# EAGLE design SolarBase731-v02 (EAGLE 5.10)
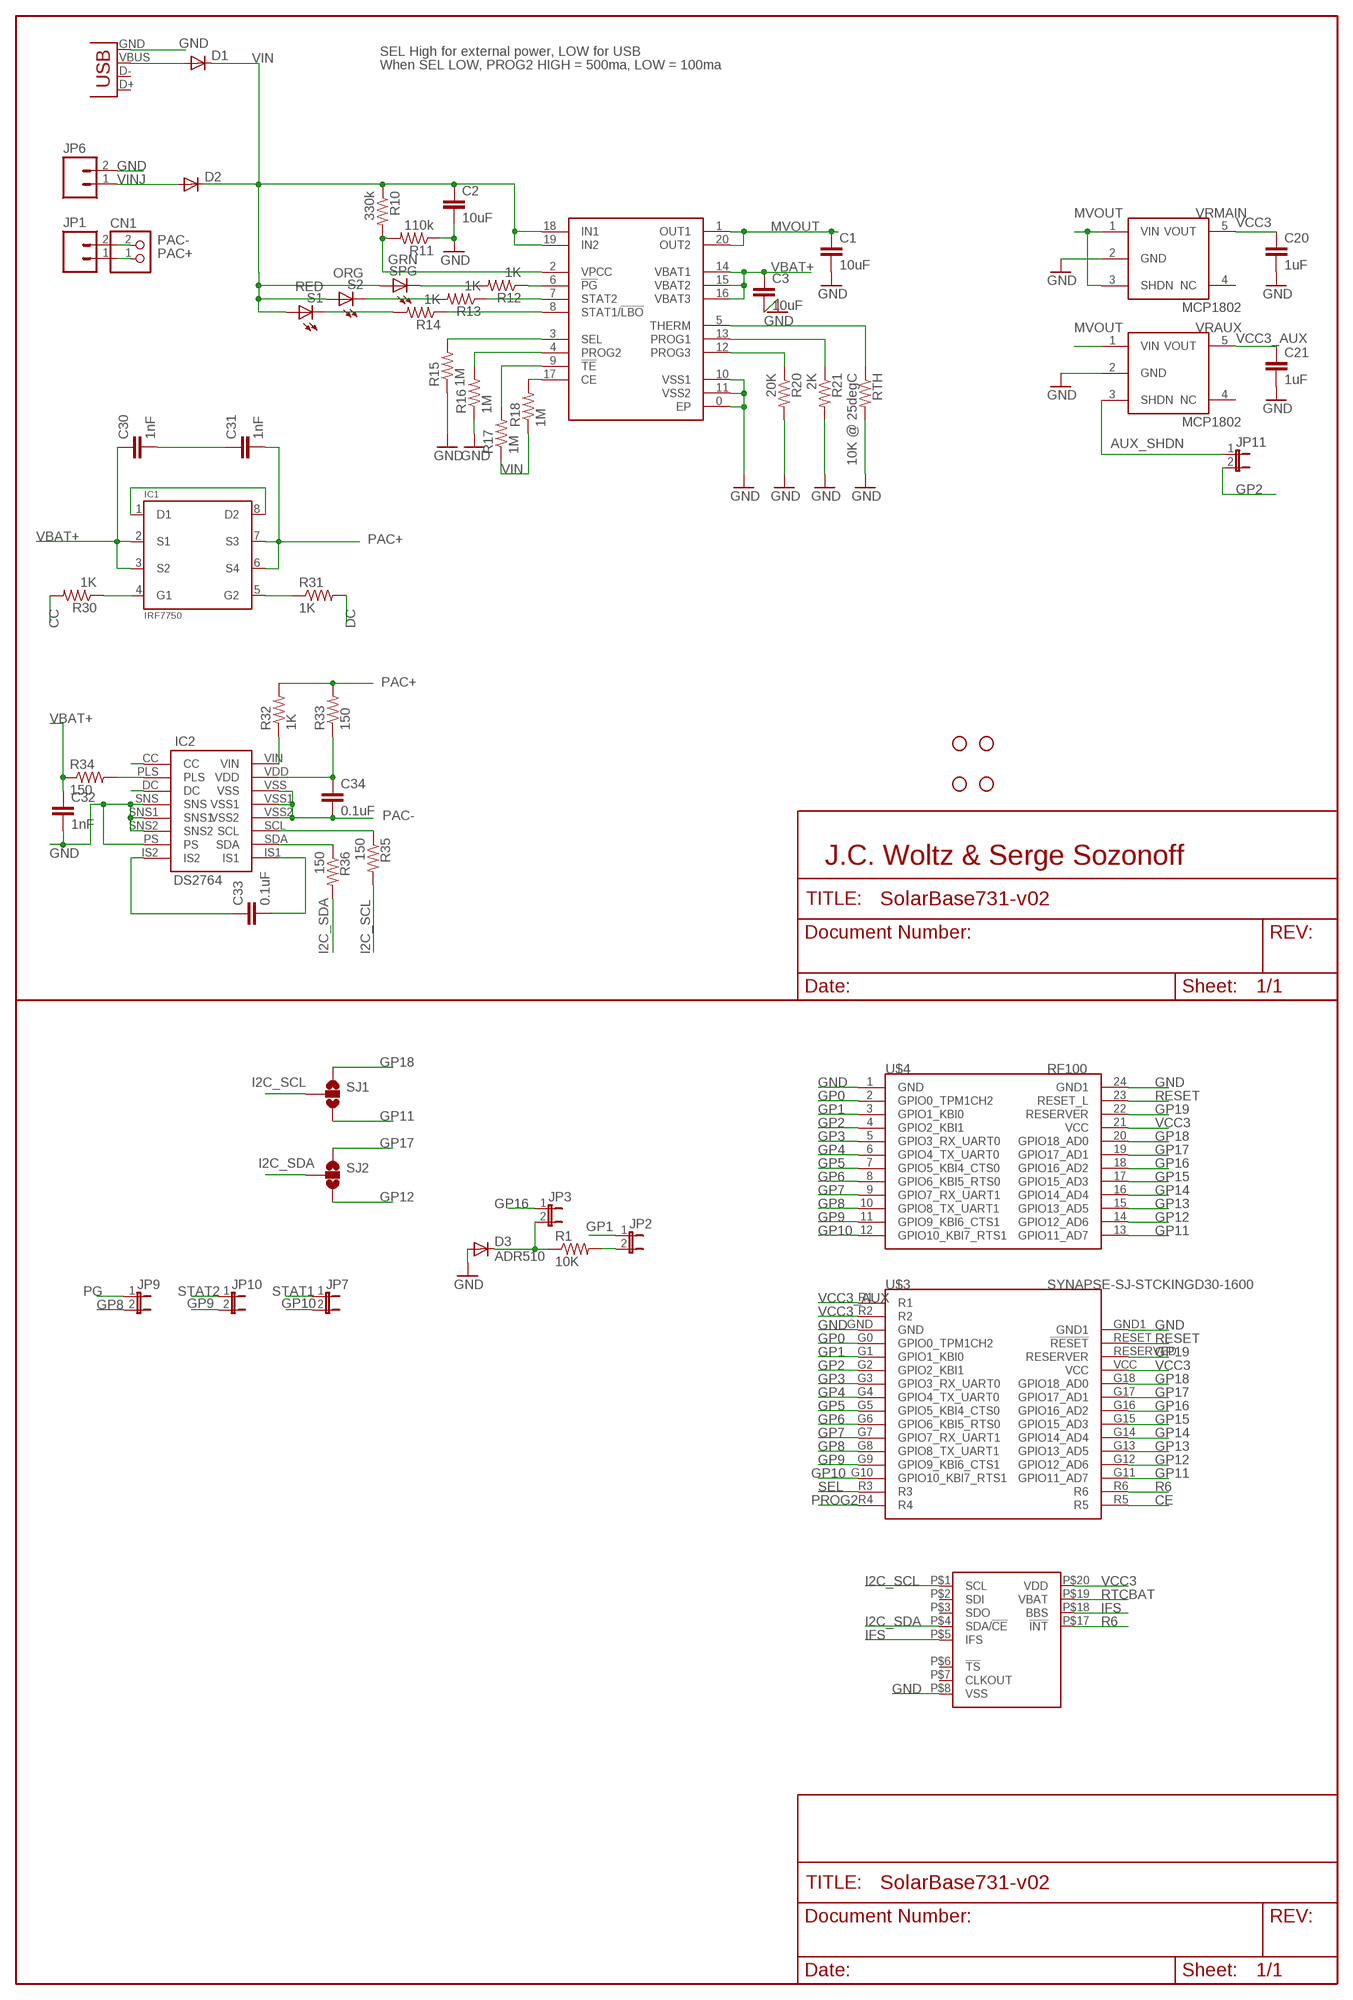
[diagram p0: schematic, sheet 1]

## Parts
C1  10uF  CAP1206  [1206]
C2  10uF  CAP1206  [1206]
C3  10uF  CAP1206  [1206]
C20  1uF  CAP0603-CAP  [0603-CAP]
C21  1uF  CAP0603-CAP  [0603-CAP]
C30  1nF  CAP0603-CAP  [0603-CAP]
C31  1nF  CAP0603-CAP  [0603-CAP]
C32  1nF  CAP0603-CAP  [0603-CAP]
C33  0.1uF  CAP0603-CAP  [0603-CAP]
C34  0.1uF  CAP0603-CAP  [0603-CAP]
CN1  JST_2PIN-THM-RA  [JST-PH-2-THM-RA]
D1  DIODESOD  [SOD-323]
D2  DIODESMA  [SMA-DIODE]
D3  ADR510  DIODESOT-23-3-ADR510  [SOT23-3]
IC1  IRF7750  [TSSOP8-4.4MM]
IC2  DS2764  [DS2764]
JP1  M02PTH  [1X02]
JP2  JUMPER-2SMD-NC  [SJ_2S]
JP3  JUMPER-2SMD-NC  [SJ_2S]
JP4  STAND-OFF  [STAND-OFF]
JP5  STAND-OFF  [STAND-OFF]
JP6  M023.5MM  [SCREWTERMINAL-3.5MM-2]
JP7  JUMPER-2SMD-NC  [SJ_2S]
JP9  JUMPER-2SMD-NC  [SJ_2S]
JP10  JUMPER-2SMD-NC  [SJ_2S]
JP11  JUMPER-2SMD-NC  [SJ_2S]
JP12  STAND-OFF  [STAND-OFF]
JP17  STAND-OFF  [STAND-OFF]
R1  10K  RESISTOR0603-RES  [0603-RES]
R10  330k  RESISTOR0603-RES  [0603-RES]
R11  110k  RESISTOR0603-RES  [0603-RES]
R12  1K  RESISTOR0603-RES  [0603-RES]
R13  1K  RESISTOR0603-RES  [0603-RES]
R14  1K  RESISTOR0603-RES  [0603-RES]
R15  1M  RESISTOR0603-RES  [0603-RES]
R16  1M  RESISTOR0603-RES  [0603-RES]
R17  1M  RESISTOR0603-RES  [0603-RES]
R18  1M  RESISTOR0603-RES  [0603-RES]
R20  20K  RESISTOR0603-RES  [0603-RES]
R21  2K  RESISTOR0603-RES  [0603-RES]
R30  1K  RESISTOR0603-RES  [0603-RES]
R31  1K  RESISTOR0603-RES  [0603-RES]
R32  1K  RESISTOR0603-RES  [0603-RES]
R33  150  RESISTOR0603-RES  [0603-RES]
R34  150  RESISTOR0603-RES  [0603-RES]
R35  150  RESISTOR0603-RES  [0603-RES]
R36  150  RESISTOR0603-RES  [0603-RES]
RTH  10K @ 25degC  RESISTOR0603-RES  [0603-RES]
S1  RED  LED0603  [LED-0603]
S2  ORG  LED0603  [LED-0603]
SJ1  SOLDERJUMPER_2WAYS  [SJ_3]
SJ2  SOLDERJUMPER_2WAYS  [SJ_3]
SPG  GRN  LED0603  [LED-0603]
U$1  PCF2129ASO20  [SO20W]
U$2  MCP73871  MCP73871QFNE  [QFN20]
U$3  SYNAPSE-SJ-STCKINGD30-1600  [SYNSJ-STACK]
U$4  SYNAPSEWIRELESS-RFENGINESTD  SYNAPSEWIRELESS-RFENGINESTDTHM  [SYNAPSERFENGINE-THM]
VRAUX  MCP1802  [SOT23-5]
VRMAIN  MCP1802  [SOT23-5]
X1  USBSMD  [USB-MINIB]

## Nets
!TE: R17.2 U$2.9(!TE)
AUX_SHDN: JP11.1 VRAUX.3(SHDN)
CC: IC2.CC R30.2
CE: R18.2 U$2.17(CE) U$3.R5
DC: IC2.DC R31.2
GND: C1.2 C2.2 C3.2 C20.2 C21.2 C32.2 D3.2(A) IC2.PS IC2.SNS IC2.SNS1 IC2.SNS2 JP6.2 R11.1 R15.1 R16.1 R20.2 R21.2 RTH.2 U$1.P$8(VSS) U$2.0(EP) U$2.10(VSS1) U$2.11(VSS2) U$3.GND U$3.GND1 U$4.1(GND) U$4.24(GND1) VRAUX.2(GND) VRMAIN.2(GND) X1.GND
GP0: U$3.G0(GPIO0_TPM1CH2) U$4.2(GPIO0_TPM1CH2)
GP1 [small_sig]: JP2.1 U$3.G1(GPIO1_KBI0) U$4.3(GPIO1_KBI0)
GP2 [small_sig]: JP11.2 U$3.G2(GPIO2_KBI1) U$4.4(GPIO2_KBI1)
GP3 [small_sig]: U$3.G3(GPIO3_RX_UART0) U$4.5(GPIO3_RX_UART0)
GP4 [small_sig]: U$3.G4(GPIO4_TX_UART0) U$4.6(GPIO4_TX_UART0)
GP5 [small_sig]: U$3.G5(GPIO5_KBI4_CTS0) U$4.7(GPIO5_KBI4_CTS0)
GP6 [small_sig]: U$3.G6(GPIO6_KBI5_RTS0) U$4.8(GPIO6_KBI5_RTS0)
GP7 [small_sig]: U$3.G7(GPIO7_RX_UART1) U$4.9(GPIO7_RX_UART1)
GP8 [small_sig]: JP9.2 U$3.G8(GPIO8_TX_UART1) U$4.10(GPIO8_TX_UART1)
GP9 [small_sig]: JP10.2 U$3.G9(GPIO9_KBI6_CTS1) U$4.11(GPIO9_KBI6_CTS1)
GP10 [small_sig]: JP7.2 U$3.G10(GPIO10_KBI7_RTS1) U$4.12(GPIO10_KBI7_RTS1)
GP11 [small_sig]: SJ1.3 U$3.G11(GPIO11_AD7) U$4.13(GPIO11_AD7)
GP12 [small_sig]: SJ2.3 U$3.G12(GPIO12_AD6) U$4.14(GPIO12_AD6)
GP13 [small_sig]: U$3.G13(GPIO13_AD5) U$4.15(GPIO13_AD5)
GP14 [small_sig]: U$3.G14(GPIO14_AD4) U$4.16(GPIO14_AD4)
GP15 [small_sig]: U$3.G15(GPIO15_AD3) U$4.17(GPIO15_AD3)
GP16 [small_sig]: JP3.1 U$3.G16(GPIO16_AD2) U$4.18(GPIO16_AD2)
GP17 [small_sig]: SJ2.1 U$3.G17(GPIO17_AD1) U$4.19(GPIO17_AD1)
GP18 [small_sig]: SJ1.1 U$3.G18(GPIO18_AD0) U$4.20(GPIO18_AD0)
GP19 [small_sig]: U$3.RESERVED(RESERVER) U$4.22(RESERVER)
I2C_SCL [small_sig]: R35.2 SJ1.2 U$1.P$1(SCL)
I2C_SDA [small_sig]: R36.2 SJ2.2 U$1.P$4(SDA/!CE)
IFS: U$1.P$5(IFS) U$1.P$18(BBS)
MVOUT: C1.1 U$2.1(OUT1) U$2.20(OUT2) VRAUX.1(VIN) VRMAIN.1(VIN) VRMAIN.3(SHDN)
N$1: IC1.1(D1) IC1.8(D2)
N$2: R12.2 SPG.C
N$3: D3.1(C) JP3.2 R1.1
N$4: JP2.2 R1.2
N$5: IC1.4(G1) R30.1
N$6: R13.2 S2.C
N$7: R14.2 S1.C
N$14: IC1.5(G2) R31.1
N$15: IC2.VIN R32.1
N$16: C33.2 IC2.IS1
N$17: IC2.SCL R35.1
N$18: C34.1 IC2.VDD R33.1
N$19: C30.2 C31.1
N$21: D1.2(A) X1.VBUS
N$23: R10.2 R11.2 U$2.2(VPCC)
N$24: C33.1 IC2.IS2
N$25: IC2.SDA R36.1
PAC+ [Vbat]: C31.2 CN1.1 IC1.6(S4) IC1.7(S3) JP1.1 R32.2 R33.2
PAC- [Vbat]: C34.2 CN1.2 IC2.VSS IC2.VSS1 IC2.VSS2 JP1.2
PG: JP9.1 R12.1 U$2.6(!PG)
PLS: IC2.PLS R34.2
PROG1: R21.1 U$2.13(PROG1)
PROG2: R16.2 U$2.4(PROG2) U$3.R4
PROG3: R20.1 U$2.12(PROG3)
R6: U$1.P$17(!INT) U$3.R6
RESET [small_sig]: U$3.RESET(!RESET) U$4.23(RESET_L)
RTCBAT: U$1.P$19(VBAT)
SEL: R15.2 U$2.3(SEL) U$3.R3
STAT1: JP7.1 R14.1 U$2.8(STAT1/!LBO)
STAT2: JP10.1 R13.1 U$2.7(STAT2)
THERM: RTH.1 U$2.5(THERM)
VBAT+ [Vbat]: C3.1 C30.1 C32.1 IC1.2(S1) IC1.3(S2) R34.1 U$2.14(VBAT1) U$2.15(VBAT2) U$2.16(VBAT3)
VCC3: C20.1 U$1.P$20(VDD) U$3.R2 U$3.VCC U$4.21(VCC) VRMAIN.5(VOUT)
VCC3_AUX: C21.1 U$3.R1 VRAUX.5(VOUT)
VIN: C2.1 D1.1(C) D2.C R10.1 R17.1 R18.1 S1.A S2.A SPG.A U$2.18(IN1) U$2.19(IN2)
VINJ: D2.A JP6.1
Unconnected: U$1.P$2(SDI) U$1.P$3(SDO) U$1.P$6(!TS) U$1.P$7(CLKOUT) VRAUX.4(NC) VRMAIN.4(NC) X1.D+ X1.D-

## Notes on the sheet
- SEL High for external power, LOW for USB
- When SEL LOW, PROG2 HIGH = 500ma, LOW = 100ma
- J.C. Woltz & Serge Sozonoff

## Library data of the parts
C1-C3 = SparkFun:CAP: Capacitor Standard 0603 ceramic capacitor, and 0.1" leaded capacitor.
C20 C21 C30-C34 = 0_jc-custom:CAP: Capacitor Standard 0603 ceramic capacitor, and 0.1" leaded capacitor.
CN1 = 0_jc-custom:JST_2PIN: JST 2-Pin Connectors of various flavors SMT-RA (S2B-PH-SM4) 4UConnector #17311 SMT (B2B-PH-SM4) THM-RA (S2B-PH) THM (B2B-PH)
D1 D2 = SparkFun:DIODE: Diode These are standard reverse protection diodes and small signal diodes. SMA package can handle up to about 1A. SOD-323 can handle about 200mA. What the SOD-323 package when ordering, there are some mfgs out there that are 5-pin packages.
D3 = 0_jc-modified:DIODE: Diode These are standard reverse protection diodes and small signal diodes. SMA package can handle up to about 1A. SOD-323 can handle about 200mA. What the SOD-323 package when ordering, there are some mfgs out there that are 5-pin packages.
IC1 = ssozonoff:IRF7750: HEXFET® power MOSFETs from International Rectifier utilize advanced processing techniques to achieve extremely low on-resistance per silicon area. This benefit, combined with the ruggedized device design, that International Rectifier is well known for, provides the designer with an extremely efficient and reliable device for battery and load management.
IC2 = ssozonoff:DS2764
JP1 JP6 = SparkFun:M02: Header 2 Standard 2-pin 0.1" header. Use with straight break away headers (SKU : PRT-00116), right angle break away headers (PRT-00553), swiss pins (PRT-00743), machine pins (PRT-00117), and female headers (PRT-00115). Molex polarized connector foot print use with SKU : PRT-08233 with associated crimp pins and housings.
JP2 JP3 JP7 JP9-JP11 = SparkFun:JUMPER-2: Jumper Basic 0.1" spaced jumper. Use with breakaway headers.
JP4 JP5 JP12 JP17 = SparkFun:STAND-OFF: Stand Off This is the mechanical footprint for a #4 phillips button head screw. Use the keepout ring to avoid running the screw head into surrounding components. SKU : PRT-00447
R1 R10-R18 R20 R21 R30-R36 RTH = 0_jc-custom:RESISTOR
S1 S2 SPG = 0_jc-custom:LED: LEDs Standard schematic elements and footprints for 5mm, 3mm, 1206, and 0603 sized LEDs. 5mm - Spark Fun Electronics SKU : COM-00529 (and others)
SJ1 SJ2 = SparkFun:SOLDERJUMPER_2WAY: Solder Jumper 2 way solder jumper
U$1 = 0_jc-custom:PCF2129A
U$2 = 0_jc-custom:MCP73871
U$3 = 0_jc-custom:SYNAPSE-SJ-STCKING: Standard layout for expansion modules using Synapse Wireless boards
U$4 = 0_jc-custom:SYNAPSEWIRELESS-RFENGINE
VRAUX VRMAIN = 0_jc-modified:MCP1802
X1 = 0_jc-custom:USB: USB Connectors USB-B-PTH is fully proven SKU : PRT-00139 USB-miniB is fully proven SKU : PRT-00587 USB-A-PCB is untested. USB-A-H is throughly reviewed, but untested. Spark Fun Electronics SKU : PRT-00437 USB-B-SMT is throughly reviewed, but untested. Needs silkscreen touching up. USB-A-S has not been used/tested USB-MB-H has not been used/tested

## Net classes
0 default: width 0.229 mm
1 Vbat: width 0.483 mm
2 small_sig: width 0.152 mm

## Board
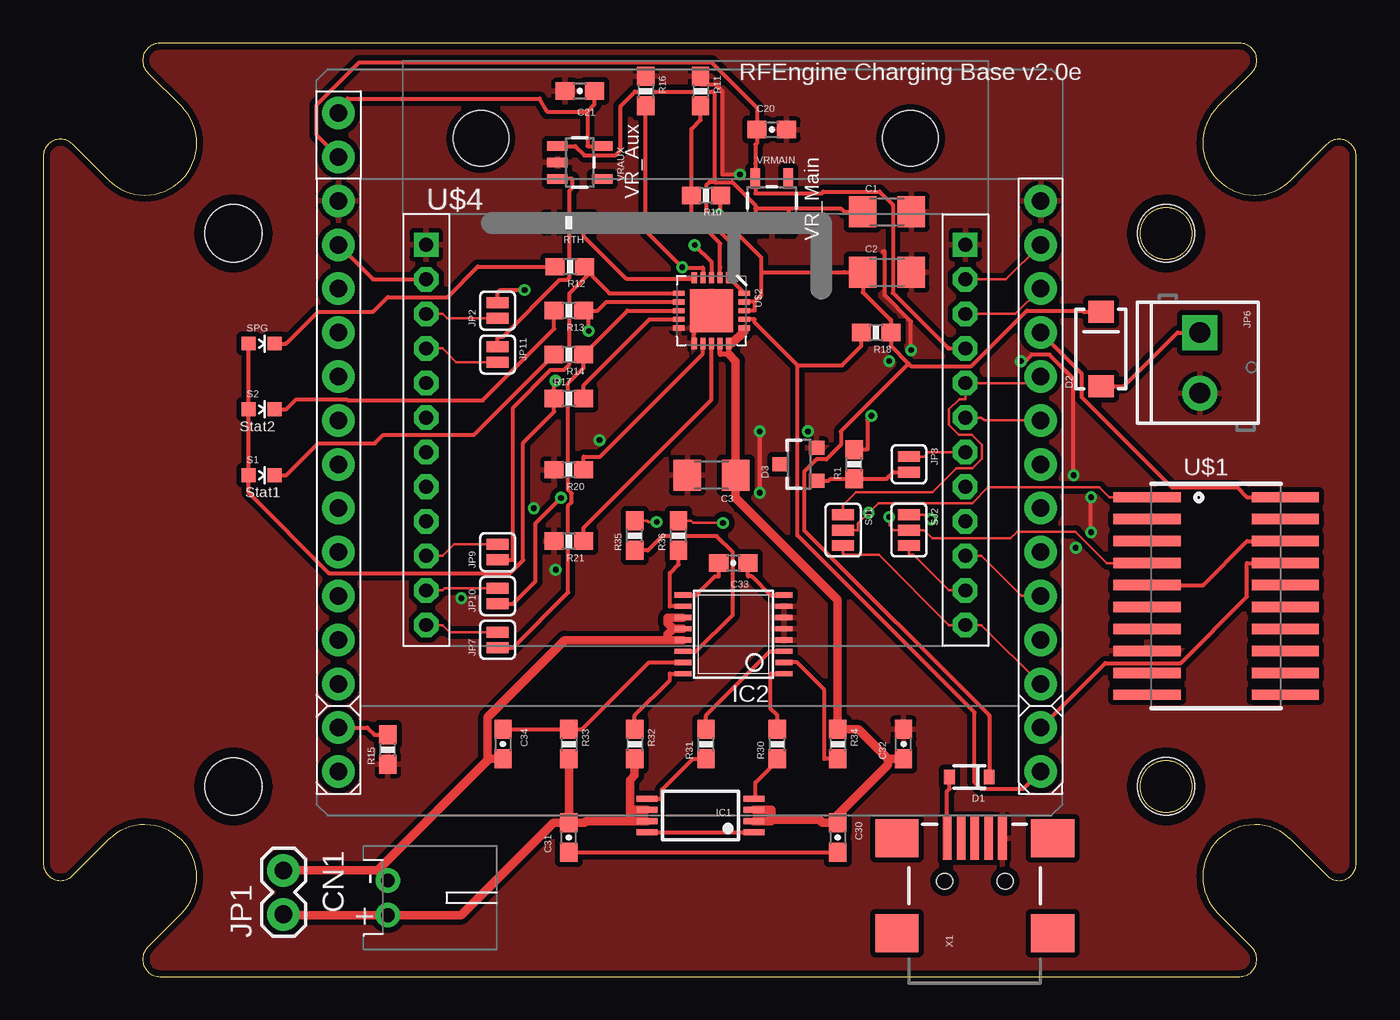
[diagram p1: board, top side]
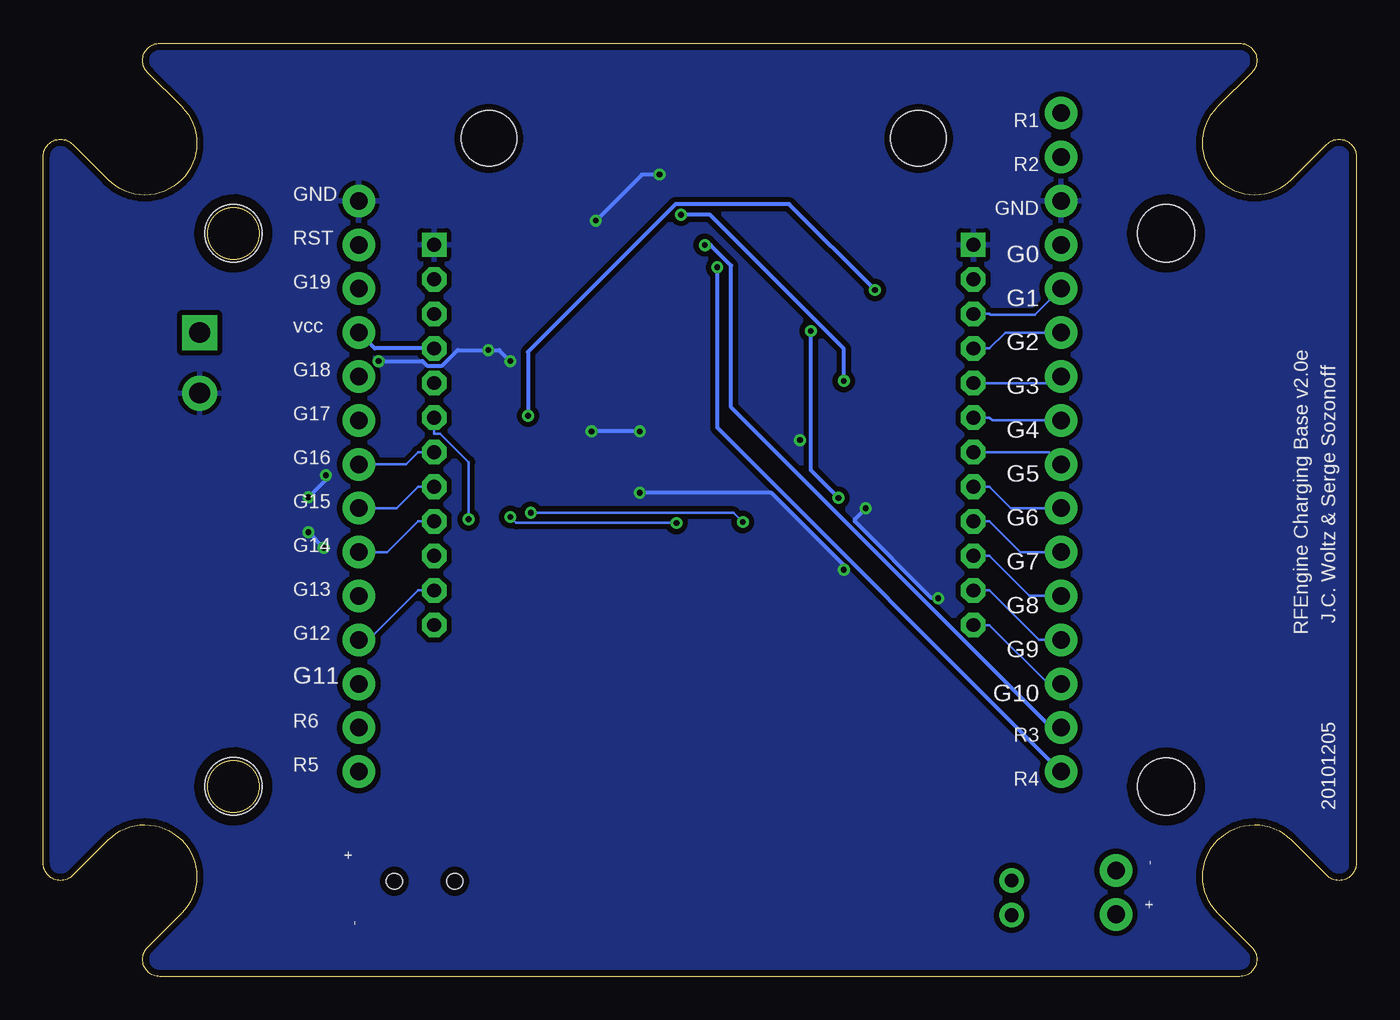
[diagram p2: board, bottom side, seen from below]

Size 76 x 54 mm. Coordinates in mm from the lower left corner, seen from the top.
Outline: 72.24,46.1 arc-180 68,50.34 69.95,52.29 arc135 69.24,54 6.75,54 arc135 6.05,52.29 8,50.34 arc-180 3.76,46.1 1.71,48.15 arc135 0,47.44 0,6.55 arc135 1.71,5.85 3.76,7.9 arc-180 8,3.66 6.05,1.71 arc135 6.75,0 69.24,0 arc135 69.95,1.71 68,3.66 arc-180 72.24,7.9 74.29,5.85 arc135 76,6.55 76,47.44 arc135 74.29,48.15 72.24,46.1
Outline: circle at 64.99,43 radius 1.5
Outline: circle at 64.99,11 radius 1.5
Copper layers (1*16): Top 0.0356mm / dielectric 1.5011mm / Bottom 0.0356mm
Design rules "LaenPCBOrder-JCModified": minimum track width 6mil, minimum drill 13mil, track to track 6mil, track to pad 6mil, pad to pad 6mil, via to via 6mil, smd to smd 6mil, copper to edge 15mil, drill to drill 6mil, minimum pad ring 12mil, minimum via ring 7mil, stop-mask expansion 4mil, vias tented up to drill 25mil, thermal gap 10mil

### Footprints (pad centres in the part's own frame; a part is rotated, then mirrored left to right if it is on the bottom)
1206 = smd 1.6 x 1.8: 1 -1.4,0; 2 1.4,0
0603-CAP = smd 1.1 x 1: 1 -0.85,0; 2 0.85,0
JST-PH-2-THM-RA = drill 0.8 pad 1.422 round: 1 1,0; 2 -1,0
SOD-323 = smd 0.63 x 0.83: 1 -1.15,0; 2 1.15,0
SMA-DIODE = smd 1.27 x 1.47: A -2.15,0; C 2.15,0
SOT23-3 = smd 0.8 x 0.9: 1 -0.95,-1; 2 0.95,-1; 3 0,1.1
TSSOP8-4.4MM = smd 1.2 x 0.35: 1 -3.1,0.975; 2 -3.1,0.325; 3 -3.1,-0.325; 4 -3.1,-0.975; 5 3.1,-0.975; 6 3.1,-0.325; 7 3.1,0.325; 8 3.1,0.975
DS2764 = smd 0.305 x 0.991: CC -2.275,-2.918; DC -0.975,-2.918; IS1 2.275,2.918; IS2 2.275,-2.918; PLS -1.625,-2.918; PS 1.625,-2.918; SCL -0.975,2.918; SDA 1.625,2.918; SNS -0.325,-2.918; SNS1 0.325,-2.918; SNS2 0.975,-2.918; VDD -1.625,2.918; VIN -2.275,2.918; VSS -0.325,2.918; VSS1 0.325,2.918; VSS2 0.975,2.918
1X02 = drill 1.016 pad 1.88 round: 1 0,0; 2 2.54,0
SJ_2S = smd 0.635 x 1.27: 1 -0.45,0; 2 0.45,0
STAND-OFF = hole 3.302: 0,0
SCREWTERMINAL-3.5MM-2 = drill 1.2 pad 2.032 square: 1 0,0 | drill 1.2 pad 2.032 round: 2 3.5,0
0603-RES = smd 1.1 x 1: 1 -0.85,0; 2 0.85,0
LED-0603 = smd 0.8 x 0.8: A 0,-0.75; C 0,0.75
SJ_3 = smd 0.635 x 1.27: 1 -0.889,0; 2 0,0; 3 0.889,0
SO20W = smd 0.6 x 3.9: P$1 -5.715,-4; P$2 -4.445,-4; P$3 -3.175,-4; P$4 -1.905,-4; P$5 -0.635,-4; P$6 0.635,-4; P$7 1.905,-4; P$8 3.175,-4; P$9 4.445,-4; P$10 5.715,-4; P$11 5.715,4; P$12 4.445,4; P$13 3.175,4; P$14 1.905,4; P$15 0.635,4; P$16 -0.635,4; P$17 -1.905,4; P$18 -3.175,4; P$19 -4.445,4; P$20 -5.715,4
QFN20 = smd 2.5 x 2.5: 0 0,0 | smd 0.65 x 0.3: 1 -1.9,1; 2 -1.9,0.5; 3 -1.9,0; 4 -1.9,-0.5; 5 -1.9,-1; 11 1.9,-1; 12 1.9,-0.5; 13 1.9,0; 14 1.9,0.5; 15 1.9,1 | smd 0.3 x 0.65: 6 -1,-1.9; 7 -0.5,-1.9; 8 0,-1.9; 9 0.5,-1.9; 10 1,-1.9; 16 1,1.9; 17 0.5,1.9; 18 0,1.9; 19 -0.5,1.9; 20 -1,1.9
SYNSJ-STACK = drill 1.016 pad 1.88 round: G0 0,-7.62; G1 0,-10.16; G2 0,-12.7; G3 0,-15.24; G4 0,-17.78; G5 0,-20.32; G6 0,-22.86; G7 0,-25.4; G8 0,-27.94; G9 0,-30.48; G10 0,-33.02; G11 40.64,-33.02; G12 40.64,-30.48; G13 40.64,-27.94; G14 40.64,-25.4; G15 40.64,-22.86; G16 40.64,-20.32; G17 40.64,-17.78; G18 40.64,-15.24; GND 0,-5.08; GND1 40.64,-5.08; R1 0,0; R2 0,-2.54; R3 0,-35.56; R4 0,-38.1; R5 40.64,-38.1; R6 40.64,-35.56; RESERVED 40.64,-10.16; RESET 40.64,-7.62; VCC 40.64,-12.7
SYNAPSERFENGINE-THM = drill 0.8 square: 1 0,0; 24 31.2,0 | drill 0.8 pad 1.422 octagon: 2 0,-2; 3 0,-4; 4 0,-6; 5 0,-8; 6 0,-10; 7 0,-12; 8 0,-14; 9 0,-16; 10 0,-18; 11 0,-20; 12 0,-22; 13 31.2,-22; 14 31.2,-20; 15 31.2,-18; 16 31.2,-16; 17 31.2,-14; 18 31.2,-12; 19 31.2,-10; 20 31.2,-8; 21 31.2,-6; 22 31.2,-4; 23 31.2,-2 | hole 3.2: 3.17,6.16; 28.03,6.16
SOT23-5 = smd 0.55 x 1.2: 1 -0.95,-1.3; 2 0,-1.3; 3 0.95,-1.3; 4 0.95,1.3; 5 -0.95,1.3
USB-MINIB = smd 2.5 x 0.5: D+ 2.5,0; D- 2.5,0.8; GND 2.5,-1.6; ID 2.5,-0.8; VBUS 2.5,1.6 | smd 2.2 x 2.5: GND@1 -3,-4.5; GND@2 -3,4.5; GND@3 2.5,4.5; GND@4 2.5,-4.5 | hole 0.9: 0,1.75; 0,-1.75

### Placement (x,y rotation side)
C1  48.84,44.24 0 top
C2  48.84,40.75 0 top
C3  38.68,29 180 top
C20  42.17,49.01 0 top
C21  31.06,51.23 180 top
C30  45.98,8.05 270 top
C31  30.42,8.05 90 top
C32  49.79,13.45 90 top
C33  39.95,23.92 180 top
C34  26.61,13.45 270 top
CN1  19.95,4.56 270 top
D1  53.6,11.54 180 top
D2  61.22,36.31 90 top
D3  43.76,29.64 90 top
IC1  38.04,9.32 180 top
IC2  39.95,19.8 90 top
JP1  13.91,3.6 90 top
JP2  26.3,38.53 90 top
JP3  50.11,29.64 270 top
JP4  64.99,43 0 top
JP5  11.01,43 0 top
JP6  66.94,37.26 270 top
JP7  26.3,19.48 90 top
JP9  26.3,24.56 90 top
JP10  26.3,22.02 90 top
JP11  26.3,35.99 270 top
JP12  64.99,11 0 top
JP17  11.01,11 0 top
R1  46.93,29.64 90 top
R10  38.36,45.2 180 top
R11  38.04,51.23 270 top
R12  30.49,41.07 180 top
R13  30.42,38.53 180 top
R14  30.42,35.99 180 top
R15  19.95,13.13 90 top
R16  34.87,51.23 270 top
R17  30.42,33.45 0 top
R18  48.2,37.26 180 top
R20  30.42,29.32 180 top
R21  30.42,25.19 180 top
R30  42.49,13.45 90 top
R31  38.36,13.45 90 top
R32  34.23,13.45 270 top
R33  30.42,13.45 270 top
R34  45.98,13.45 270 top
R35  34.23,25.51 90 top
R36  36.77,25.51 90 top
RTH  30.42,43.61 180 top
S1  12.64,29 270 top
S2  12.64,32.81 270 top
SJ1  46.3,25.83 270 top
SJ2  50.11,25.83 270 top
SPG  12.64,36.62 270 top
U$1  67.89,22.02 270 top
U$2  38.68,38.53 270 top
U$3  17.09,49.96 0 top
U$4  22.17,42.34 0 top
VRAUX  31.06,47.1 270 top
VRMAIN  42.17,44.88 0 top
X1  53.92,5.51 90 top

### Tracks (layer width: path | path; a pad name or v marks a point on that pad's centre or on a via)
!TE
  Top 0.229: U$2.9 36.19,38.03 35.09,38.03 31.27,34.21 R17.2
AUX_SHDN
  Top 0.229: JP11.1 26.3,37.02 26.61,37.02 29.89,40.3 30.3,40.3 30.45,40.46 30.45,45.45 30.63,45.63 30.63,46.15 VRAUX.3
CC
  Top 0.229: IC2.CC 42.11,17.52 42.11,15.5 42.49,15.11 R30.2
CE
  Top 0.229: U$2.17 41.17,38.03 41.17,37.85 43.66,35.37 | 43.66,35.37 43.66,25.53 53.9,15.28 53.9,11.24 54.29,10.86 56.73,10.86 U$3.R5 | 43.66,35.37 46.23,35.37 47.35,36.49 R18.2
DC
  Top 0.229: R31.2 38.36,15.11 42.07,18.82 IC2.DC
GND  (via drill 0.33)
  Top 0.229: v50.24,36.24 50.24,37.89 48.71,39.42 48.71,41.96 48.6,41.96 | v40.33,46.4 39.31,46.4 39.31,51.23 38.93,51.61 38.04,51.61 38.04,51.99 R11.1 | v41.47,27.99 v41.47,31.54 | v56.59,35.61 56.84,35.61 57.22,35.99 58.24,35.99 59.63,34.59 v59.63,29 | v60.65,25.7 v60.65,27.73 | U$2.0 37.66,38.53 37.66,36.75 U$2.11
  Bottom 0.229: v48.97,35.61 49.6,36.24 v50.24,36.24 52.01,36.24 52.9,35.35 53.79,35.35 54.05,35.61 v56.59,35.61 | v44.01,43.73 41.35,46.4 v40.33,46.4 | v41.47,31.54 v44.27,31.54 | v41.47,27.99 33.85,27.99 29.66,23.8 v29.66,23.54 | v24.2,21.89 24.58,21.89 29.03,26.34 29.03,26.46 v28.39,27.1 | v59.63,29 59.63,28.75 v60.65,27.73 | v59.76,24.81 v60.65,25.7
  other vias: 32.2,31.03
  pour Top (isolate 0.305): -0.69,0.43 -0.69,53.77 75.51,53.77 75.51,0.43
  pour Bottom (isolate 0.305): 0.58,53.77 0.58,0.43 75.51,0.43 75.51,53.77
GP0
  Top 0.229: U$4.2 19.09,40.34 U$3.G0
GP1
  Top 0.152: JP2.1 25.43,38.08 23.37,38.08 23.11,38.34 U$4.3
  Bottom 0.152: U$4.3 21.23,38.34 21.18,38.28 18.6,38.28 U$3.G1
GP2
  Top 0.152: JP11.2 25.43,35.54 23.91,35.54 23.11,36.34 U$4.4
  Bottom 0.152: U$4.4 21.23,36.34 20.31,37.26 U$3.G2
GP3
  Bottom 0.152: U$4.5 17.47,34.34 U$3.G3
GP4
  Bottom 0.152: U$4.6 21.23,32.34 21.07,32.18 U$3.G4
GP5
  Bottom 0.152: U$4.7 21.23,30.34 17.79,30.34 U$3.G5
GP6
  Bottom 0.152: U$4.8 21.23,28.34 19.99,27.1 U$3.G6
GP7
  Bottom 0.152: U$4.9 21.23,26.34 19.45,24.56 U$3.G7
GP8
  Top 0.152: U$4.10 23.11,24.34 23.78,25.01 JP9.2
  Bottom 0.152: U$4.10 21.23,24.34 18.91,22.02 U$3.G8
GP9
  Top 0.152: JP10.2 25.43,22.47 23.24,22.47 23.11,22.34 U$4.11
  Bottom 0.152: U$4.11 21.23,22.34 18.37,19.48 U$3.G9
GP10
  Top 0.152: JP7.2 25.43,19.93 23.52,19.93 23.11,20.34 U$4.12
  Bottom 0.152: U$4.12 21.23,20.34 17.83,16.94 U$3.G10
GP11
  Top 0.152: SJ1.3 46.3,24.39 48.37,24.39 52.43,20.34 U$4.13 54.31,20.34 57.71,16.94 U$3.G11
GP12
  Top 0.152: SJ2.3 50.11,24.39 50.37,24.39 52.43,22.34 U$4.14
  Bottom 0.152: U$4.14 54.31,22.34 57.17,19.48 U$3.G12
GP13
  Top 0.152: U$4.15 54.31,24.34 56.63,22.02 U$3.G13
GP14
  Bottom 0.152: U$4.16 54.31,26.34 56.09,24.56 U$3.G14
GP15
  Bottom 0.152: U$4.17 54.31,28.34 55.55,27.1 U$3.G15
GP16
  Top 0.152: U$4.18 52.43,30.34 51.22,30.34 50.97,30.09 JP3.1
  Bottom 0.152: U$4.18 54.31,30.34 55.01,29.64 U$3.G16
GP17  (via drill 0.33 pad 0.69)
  Top 0.152: SJ2.1 50.97,26.72 51.24,26.45 v51.38,26.45 | U$3.G17 54.47,32.18 54.31,32.34 U$4.19
  Bottom 0.152: U$4.19 53.37,31.4 53.02,31.4 51.38,29.76 v51.38,26.45
GP18
  Top 0.152: U$3.G18 57.35,34.34 U$4.20 53.37,33.4 53.02,33.4 52.43,32.81 52.43,31.91 53.01,31.34 53.76,31.34 54.33,30.77 54.33,29.95 53.78,29.4 52.85,29.4 51.46,28.01 47.05,28.01 46.3,27.26 SJ1.1
GP19
  Top 0.152: U$4.22 56.27,38.34 U$3.RESERVED
I2C_SCL  (via drill 0.33 pad 0.69)
  Top 0.152: U$1.P$1 61.71,27.73 61.14,28.31 54.68,28.31 53.77,27.39 48.34,27.39 v47.78,26.83 47.16,26.22 47.16,25.83 SJ1.2 | R35.2 34.96,26.36 35.03,26.3 v35.5,26.3
  Bottom 0.152: v47.78,26.83 36.04,26.83 v35.5,26.3
I2C_SDA  (via drill 0.33 pad 0.69)
  Top 0.152: U$1.P$4 61.56,23.92 59.74,25.74 56.38,25.74 55.98,25.34 51.46,25.34 50.97,25.83 SJ2.2 49.25,25.83 48.97,26.11 v48.97,26.59 | R36.2 37.5,26.36 37.62,26.24 v39.35,26.24
  Bottom 0.152: v48.97,26.59 48.62,26.24 v39.35,26.24
IFS
  Top 0.229: U$1.P$18 69.67,25.19 67.13,22.65 U$1.P$5
MVOUT
  Top 0.229: 38.84,45.96 38.55,45.96 38.36,45.77 38.36,43.9 39.68,42.58 U$2.1 U$2.20 | VRAUX.1 30.79,48.05 31.33,47.51 33.11,47.51 33.4,47.8 33.4,50.35 34.25,51.19 38.73,51.19 38.84,51.08 38.84,45.96 | 38.84,45.96 39.89,45.96 41.22,44.63 41.22,44.44 | 41.22,44.44 VRMAIN.1 | 41.22,44.44 43.12,44.44 | C1.1 46.37,44.24 46.17,44.44 43.12,44.44 | 43.12,44.44 VRMAIN.3
N$1
  Top 0.229: IC1.8 IC1.1
N$2
  Top 0.229: SPG.C 14.06,36.62 15.9,38.46 19.09,38.46 19.94,39.32 23.4,39.32 25.15,41.07 R12.2
N$3
  Top 0.229: D3.1 45.48,28.69 45.58,28.79 R1.1 48.81,28.79 49.21,29.19 JP3.2
N$4  (via drill 0.33 pad 0.69)
  Top 0.229: R1.2 47.7,30.49 47.7,32.2 v47.94,32.44 | JP2.2 26.3,39.56 26.46,39.72 v27.86,39.72
  Bottom 0.229: v47.94,32.44 47.94,36.14 39.4,44.69 32.82,44.69 v27.86,39.72
N$5
  Top 0.229: IC1.4 41.22,10.33 41.22,11.22 42.49,12.49 R30.1
N$6
  Top 0.229: S2.C 14.06,32.81 14.65,33.4 17.57,33.4 17.64,33.34 25.44,33.34 29.57,37.48 R13.2
N$7
  Top 0.229: S1.C 14.06,29 15.9,30.84 19.19,30.84 19.68,31.34 24.92,31.34 R14.2
N$14
  Top 0.229: IC1.5 35.81,10.29 35.81,10.81 37.6,12.6 R31.1
N$15
  Top 0.229: IC2.VIN 36.27,17.52 36.27,17.15 34.23,15.11 R32.1
N$16
  Top 0.229: C33.2 39.1,23.16 38.88,23.16 37.79,22.07 IC2.IS1
N$17
  Top 0.229: IC2.SCL 37.79,18.82 39.92,20.94 39.92,24.54 38.98,25.48 35.82,25.48 35,24.66 R35.1
N$18
  Top 0.229: IC2.VDD 36.27,18.17 35.07,18.17 31.19,14.3 R33.1 C34.1
N$19
  Top 0.229: C31.1 C30.2
N$21
  Top 0.229: D1.2 52.45,10.86 52.32,10.73 X1.VBUS
N$23
  Top 0.229: U$2.2 39.18,41.02 39.18,42.42 37.51,44.09 R10.2 37.51,49.03 38.04,49.56 R11.2
N$24
  Top 0.229: C33.1 40.8,23.16 41.02,23.16 42.11,22.07 IC2.IS2
N$25
  Top 0.229: R36.1 36.77,23.84 36.27,23.34 36.27,21.42 IC2.SDA
PAC+
  Top 0.483: R32.2 34.23,11.65 33.95,11.37 33.95,9.64 | C31.2 R33.2 | JP1.1 13.96,3.56 CN1.1 24.19,3.56 29.53,8.9 C31.2 | 33.95,8.99 31.41,8.99 31.32,8.9 C31.2 | 33.95,8.99 34.11,8.99 IC1.7 | 33.95,8.99 33.95,9.64 | 33.95,9.64 IC1.6
PAC-
  Top 0.483: 19.36,6.14 25.72,12.5 25.72,12.6 | 19.36,6.14 CN1.2 | JP1.2 19.36,6.14 | 36.14,19.47 30.18,19.47 25.72,15.01 25.72,12.6 | 25.72,12.6 C34.2 | 36.14,19.47 36.14,19.8 36.47,20.12 | 36.47,20.12 IC2.VSS1 | 36.47,20.12 36.14,20.44 36.14,20.77 IC2.VSS2 | 36.14,19.47 IC2.VSS
PG
  Top 0.229: JP9.1 27.2,24.11 27.2,32.92 29.38,35.1 30.14,35.1 30.46,35.42 30.46,39.53 31.61,40.68 | 31.61,40.68 31.34,40.68 R12.1 | 31.61,40.68 32.77,39.53 36.19,39.53 U$2.6
PLS
  Top 0.229: IC2.PLS 43.63,18.17 45.22,16.58 45.22,12.6 R34.2
PROG1
  Top 0.229: R21.1 31.27,25.96 38.68,33.36 U$2.13
PROG2  (via drill 0.33 pad 0.69)
  Top 0.229: R16.2 34.87,43.15 v36.99,41.03 37,41.02 38.18,41.02 U$2.4
  Bottom 0.229: U$3.R4 36.99,31.75 v36.99,41.03
PROG3
  Top 0.229: U$2.12 38.18,36.04 32.23,30.09 31.27,30.09 R20.1
R6
  Top 0.229: U$1.P$17 69.67,23.92 69.67,21.98 65.83,18.14 61.47,18.14 U$3.R6
RESET
  Top 0.152: U$4.23 55.73,40.34 U$3.RESET
SEL  (via drill 0.33 pad 0.69)
  Top 0.229: v37.7,42.32 38.68,41.34 U$2.3 | R15.2 19.18,13.98 18.76,14.4 U$3.R3
  Bottom 0.229: U$3.R3 17.65,14.4 36.18,32.92 36.18,41.13 37.37,42.32 v37.7,42.32
STAT1
  Top 0.229: U$2.8 33.81,38.53 R14.1 31.27,35.22 30.39,34.34 30.39,28.14 30.58,27.95 30.58,27.44 30.39,27.25 30.39,22.22 27.2,19.03 JP7.1
STAT2  (via drill 0.33 pad 0.69)
  Top 0.229: JP10.1 27.2,21.57 28.49,22.86 28.49,26.21 v29.97,27.7 | 31.73,38.53 31.57,38.37 v31.57,37.35 | 31.73,38.53 32.09,38.53 32.59,39.03 U$2.7 | 31.73,38.53 R13.1
  Bottom 0.229: v31.57,37.35 31.57,29.3 v29.97,27.7
THERM
  Top 0.229: RTH.1 31.27,42.84 33.74,40.37 37.63,40.37 U$2.5
VBAT+
  Top 0.3: U$2.14 39.18,36 39.68,36 U$2.15 39.78,36.63 | 40.58,37.48 U$2.16
  Top 0.483: 39.68,36 40.08,35.6 C3.1 40.08,27.71 45.98,21.81 R34.1 47.2,14.3 48.9,12.6 | 45.54,8.9 48.9,12.26 48.9,12.6 | 45.54,8.9 45.09,8.9 44.92,9.06 42.14,9.06 | 45.54,8.9 C30.1 | 48.9,12.6 C32.1 | IC1.2 42.14,8.99 42.14,9.06 | 42.14,9.06 42.14,9.64 IC1.3 | 40.58,37.48 40.58,37.33 39.87,36.63 39.78,36.63
VCC3
  Top 0.229: U$1.P$20 69.67,27.73 69.11,28.3 65.33,28.3 60.1,33.53 60.1,34.89 U$3.VCC | U$3.R2 15.84,48.67 15.84,50.44 18.29,52.89 38.69,52.89 41.32,50.26 C20.1 41.32,48.94 41.32,48.24 41.22,48.14 41.22,47.04 VRMAIN.5 41.22,45.31 45.05,45.31 45.15,45.41 48.4,45.41 49.17,44.64 49.17,39.56 52.39,36.34 U$4.21
  Bottom 0.229: U$4.21 56.81,36.34 U$3.VCC
VCC3_AUX
  Top 0.229: C21.1 31.91,50.46 31.49,50.04 | 31.49,50.04 31.49,48.05 VRAUX.5 | U$3.R1 17.61,50.79 28.74,50.79 29.17,50.04 31.49,50.04
VIN  (via drill 0.33 pad 0.69)
  Top 0.229: 41.17,39.03 41.55,39.41 41.55,40.75 | 41.17,39.03 41.17,38.53 U$2.18 | 41.55,40.75 41.55,41.61 v39.08,44.08 39.21,44.2 R10.1 | 41.55,40.75 46.37,40.75 C2.1 47.44,39.58 49,38.02 49.05,38.02 49.05,37.45 R18.1 49.05,36.49 50.08,35.46 | 41.17,39.03 U$2.19 | 50.08,35.46 50.23,35.32 53.73,35.32 56.94,38.53 60.15,38.53 60.22,38.46 D2.C | 50.08,35.46 46.17,31.55 46.17,30.77 45.32,29.92 44.76,29.92 44.04,29.2 44.04,25.82 54.75,15.11 D1.1 | SPG.A S2.A S1.A 11.89,27.98 16.53,23.34 27.01,23.34 27.78,24.1 27.78,30.88 29.57,32.68 R17.1 29.57,33.83 29.57,34.21 29.66,34.3 v29.66,34.46
  Bottom 0.229: v39.08,44.08 37.42,44.08 29.66,36.32 v29.66,34.46
VINJ
  Top 0.229: JP6.1 65.65,37.26 62.55,34.15 D2.A

### Text on the board
tPlace: RFEngine Charging Base v2.0e | VR_Aux | VR_Main | Stat2 | Stat1
bPlace: R1 | R2 | GND | GND | G0 | RST | G1 | G19 | G2 | vcc | G3 | G18 | G4 | G17 | G5 | G16 | G6 | G15 | G7 | G14 | G8 | G13 | J.C. Woltz & Serge Sozonoff | RFEngine Charging Base v2.0e | G9 | G12 | G10 | G11 | R3 | R6 | R4 | R5 | 20101205 | - | + | + | -